# Altium schematic sheet SelfDrivingCar_SCH_PowerBoard.SchDoc: Power Distribution Schematic
size A; DocumentNumber: Power Distribution Schematic; SheetNumber: 3; SheetTotal: 7
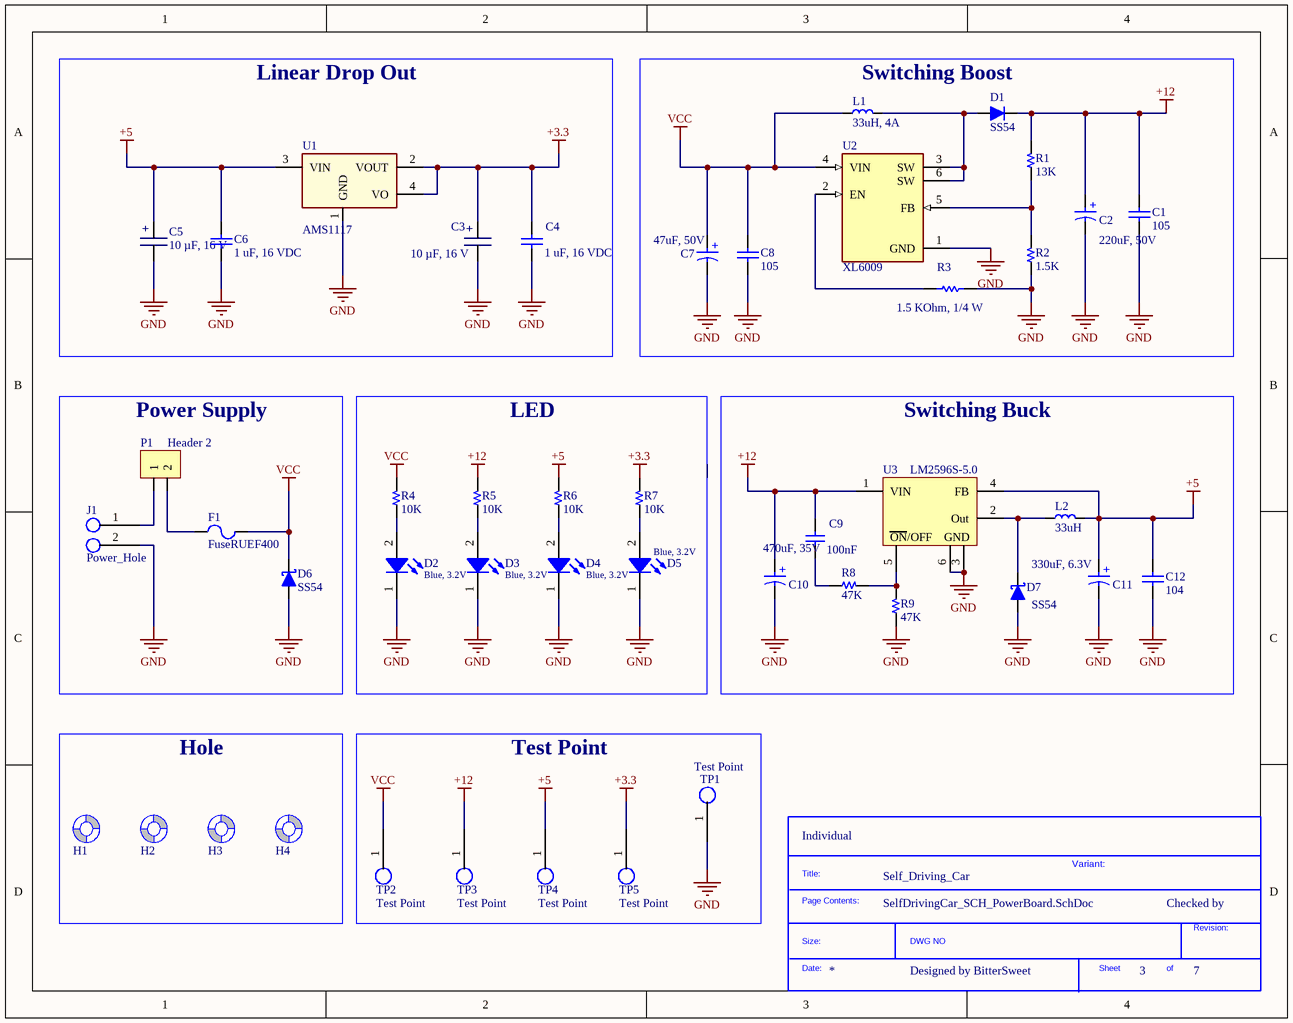
[diagram p0: SelfDrivingCar_SCH_PowerBoard.SchDoc]

## Parts
*?  SDTitleBlock  (value not drawn)  (graphical)
C1  105  [tu 1206]
C2  220uF, 50V  [WCAP-ASLI_D10H10.5]
C3  10 µF, 16 V  [TANTALUM SMD A]
C4  1 uF, 16 VDC  [CAP_0603]
C5  10 µF, 16 V  [TANTALUM SMD A]
C6  1 uF, 16 VDC  [CAP_0603]
C7  47uF, 50V  [WCAP-ASLI_D6.3H7.7]
C8  105  [tu 1206]
C9  100nF  [C 0805]
C10  470uF, 35V  [WCAP-ASLI_D10H10.5]
C11  330uF, 6.3V  [WCAP-ASLI_D6.3H7.7]
C12  104  [tu 0805]
D1  SS54  [DO-214AB (SMC)]
D2  Blue, 3.2V  [WL-SMCW_0805]
D3  Blue, 3.2V  [WL-SMCW_0805]
D4  Blue, 3.2V  [WL-SMCW_0805]
D5  Blue, 3.2V  [WL-SMCW_0805]
D6  SS54  [DO-214AC (SMA)]
D7  SS54  [DO-214AC (SMA)]
F1  FuseRUEF400  [FuseRUEF400]
H1  Screw Hole  [SCREW/3.2/7.0/M]  (value not drawn)  (no BOM)
H2  Screw Hole  [SCREW/3.2/7.0/M]  (value not drawn)  (no BOM)
H3  Screw Hole  [SCREW/3.2/7.0/M]  (value not drawn)  (no BOM)
H4  Screw Hole  [SCREW/3.2/7.0/M]  (value not drawn)  (no BOM)
J1  Power_Hole  [Power_Hole_2mm_THT]
L1  33uH, 4A  [Inductor SMD 12x12x8]
L2  33uH  [Inductor SMD 12x12x8]
P1  Header 2  [HDR/Terminal/2/3.5mm]
R1  13K  [R 0603]
R2  1.5K  [R 0603]
R3  1.5 KOhm, 1/4 W  [resistor_0603]
R4  10K  [R 0603]
R5  10K  [R 0603]
R6  10K  [R 0603]
R7  10K  [R 0603]
R8  47K  [R 0603]
R9  47K  [R 0603]
TP1  Test Point  [TP_1_5mm_SMD]
TP2  Test Point  [TP_1_5mm_SMD]
TP3  Test Point  [TP_1_5mm_SMD]
TP4  Test Point  [TP_1_5mm_SMD]
TP5  Test Point  [TP_1_5mm_SMD]
U1  AMS1117  [SOT-223]
U2  XL6009  [XL6009]
U3  LM2596S-5.0  [TO-263-5]

## Blocks framed on the sheet
Linear Drop Out: C3-C6 U1
Switching Boost: C1 C2 C7 C8 D1 L1 R1-R3 U2
Power Supply: D6 F1 J1 P1
LED: D2-D5 R4-R7
Switching Buck: C9-C12 D7 L2 R8 R9 U3
Hole: H1-H4
Test Point: TP1-TP5

## Nets
+3.3: C3.2 C4.2 R7.2 TP5.1 U1.2(VOUT) U1.4(VO)
+5: C5.2 C6.2 C11.1(P) C12.1 L2.2 R6.2 TP4.1 U1.3(VIN) U3.4(FB)
+12: C1.1 C2.1(P) C9.1 C10.1(P) D1.2(K) R1.2 R5.2 TP3.1 U3.1(VIN)
GND: C1.2 C2.2(N) C3.1 C4.1 C5.1 C6.1 C7.2(N) C8.2 C10.2(N) C11.2(N) C12.2 D2.1(K) D3.1(K) D4.1(K) D5.1(K) D6.1(A) D7.1(A) J1.2 R2.1 R3.2 R9.1 TP1.1 U1.1(GND) U2.1(GND) U3.3(GND) U3.6(PAD)
VCC: C7.1(P) C8.1 D6.2(K) F1.2 L1.1 R4.2 TP2.1 U2.4(VIN)
NetC9_2: C9.2 R8.1
NetD1_1: D1.1(A) L1.2 U2.3(SW) U2.6(SW)
NetD2_2: D2.2(A) R4.1
NetD3_2: D3.2(A) R5.1
NetD4_2: D4.2(A) R6.1
NetD5_2: D5.2(A) R7.1
NetD7_2: D7.2(K) L2.1 U3.2(Out)
NetF1_1: F1.1 P1.2
NetJ1_1: J1.1 P1.1
NetR1_1: R1.1 R2.2 U2.5(FB)
NetR3_1: R3.1 U2.2(EN)
NetR8_2: R8.2 R9.2 U3.5(~{ON}/OFF)

Not connected (* = marked no-connect by the designer): H1 1(Screw); H2 1(Screw); H3 1(Screw); H4 1(Screw)

## Notes on the sheet
- (near *?) Individual
- Self_Driving_Car
- Variant:
- Checked by
- Designed by BitterSweet
- (in symbol 01120610610) +
- (in symbol 865080145010) +
- (in symbol 865080645012) +
- (in symbol 865080657018) +
- (in symbol 0710101508650801570160U20) +
- (in symbol LM2596S-5.0) ON/OFF
- (in symbol SDTitleBlock) Title:; Page Contents:; Revision:; Size:; DWG NO; Date:; Sheet; of

## Library data of the parts
C1 C8 = Tu 1206 105 50V 20%: Dán; Don_Vi: Con; So_Chan: 2; Ten_Linh_Kien: Tụ 1206 105-1uF 10% 16V; Ma_Hang: MH004545; Chung_Loai: Dán; Kieu_Chan: *; ComponentLink1Description: URL; ComponentLink1URL: https://www.thegioiic.com/tu-gom-1206-1uf-16v; SUPPLIER NAME: JLCPCB; SUPPLIER SN: C141215; SUPPLIER URL: https://jlcpcb.com/partdetail/Kemet-C1206X105K5RAC7800/C141215
C2 = 865080657018: V-Chip, D10 x H10.5mm, 220uF, 50V; Manufacturer: Wurth Elektronik; Capacitance Tolerance: +/-20%; Dissipation Factor: 12%; Endurance: 2000h; Leakage Current: 110uA; Ripple Current: 650mA; Category: Aluminum Electrolytic Capacitors; ComponentLink2Description: Datasheet Link; ComponentLink2URL: https://www.we-online.com/redexpert/spec/865080657018?ad; Mount: Surface Mount; Operating Temperature Max: 105°C; Operating Temperature Min: -55°C; Packaging: Tape and Reel; Height: 10.5mm; Diameter: 10mm; Capacitance: 220uF; Rated Voltage (DC): 50V; Supplier 1 Name: Mouser; Supplier 1 SN: 710-865080657018; Supplier 1 URL: https://www.mouser.vn/ProductDetail/Wurth-Elektronik/865080657018?qs=0KOYDY2FL28CcgHzg1XTuA%3D%3D; Supplier 3 Name: thegioiic; Supplier 3 URL: https://www.thegioiic.com/tu-nhom-smd-220uf-50v-10x10-5mm; Manufacturer Part Number: N/A; Supplier 2 Name: Digi-Key; Supplier 2 SN: N/A; Supplier 2 URL: N/A; Supplier 3 SN: N/A; Value: 220uF, 50V; ComponentLink3Description: URL; ComponentLink3URL: https://www.thegioiic.com/tu-nhom-smd-220uf-50v-10x10-5mm; SUPPLIER NAME: JLCPCB; SUPPLIER SN: C5289735; SUPPLIER URL: https://jlcpcb.com/partdetail/aishi_aihua_group-EMK1HM221GB0D00R/C5289735
C3 C5 = 01120610610: CAP TANT 10uF 10% 16V 1206; Manufacture  Name: KYOCERA AVX; Manufacture  SN: TPSA106K016R1000; Capacitance Tolerance: +/-10%; ComponentLink1Description: Datasheet link; ComponentLink1URL: https://datasheets.kyocera-avx.com/TAJ.pdf; ComponentLink2Description: Supplier 1 URL; ComponentLink2URL: https://www.mouser.vn/ProductDetail/KYOCERA-AVX/TPSA106K016R1000?qs=GLv2FRWg8zkKT7IxHlCjvQ%3D%3D; Size: 1206; Mounting Technology: SMT; Capacitance: 10uF; ComponentLink3Description: Supplier 2 URL; ComponentLink3URL: https://www.digikey.com/en/products/detail/kyocera-avx/TPSA106K016R1000/7536120; ComponentLink4Description: Supplier 3 URL; ComponentLink4URL: https://www.thegioiic.com/tu-tantalum-10uf-16v-1206-taja106k016rnj; Supplier 1 Name: Mouser; Supplier 1 SN: 581-TPSA106K016R1000; Supplier 1 URL: https://www.mouser.vn/ProductDetail/KYOCERA-AVX/TPSA106K016R1000?qs=GLv2FRWg8zkKT7IxHlCjvQ%3D%3D; Supplier 2 Name: Digi-Key; Supplier 2 SN: 478-10757-1-ND; Supplier 2 URL: https://www.digikey.com/en/products/detail/kyocera-avx/TPSA106K016R1000/7536120; Supplier 3 Name: thegioiic; Supplier 3 SN: N/A; Supplier 3 URL: https://www.thegioiic.com/tu-tantalum-10uf-16v-1206-taja106k016rnj; Value: 10 µF, 16 V; Rated Voltage: 16 V; ComponentLink5Description: URL; ComponentLink5URL: https://www.thegioiic.com/tu-tantalum-10uf-16v-1206-taja106k016rnj; SUPPLIER NAME: JLCPCB; SUPPLIER SN: C128857; SUPPLIER URL: https://jlcpcb.com/partdetail/Yageo-CC1206KKX5R7BB106/C128857
C4 C6 = 0106031051016: CAP, size 0603, 1 uF, 16 VDC; Manufacture Name: Samsung Electro-Mechanics; Manufacture SN: CL10B105KO8NNWC; Capacitance: 1 uF; Tolerance: +/-10%; Voltage Rating DC: 16 VDC; ComponentLink2Description: Datasheet; ComponentLink2URL: https://www.mouser.vn/datasheet/2/585/Samsung_MLCC_1837944-1929650.pdf; Operating Temperature: -55 to +125degC; Packaging: Tape and Reel; Mounting Technology: SMT; Size: 0603; Supplier 1 Name: Mouser; Supplier 1 SN: 187-CL10B105KO8NNWC; Supplier 1 URL: https://www.mouser.vn/ProductDetail/Samsung-Electro-Mechanics/CL10B105KO8NNWC?qs=81r%252BiQLm7BT%252BXtc72qn1ug%3D%3D&utm_source=mouser-refine-download&utm_medium=file&utm_campaign=CL10B105KO8NNWC&utm_content=Samsung-Electro-Mechanics; Supplier 2 Name: Digi-Key; Supplier 2 SN: 1276-CL10B105KO8NNWCTR-ND; Supplier 2 URL: https://www.digikey.com/en/products/detail/samsung-electro-mechanics/cl10b105ko8nnwc/16572783; Supplier 3 Name: thegioiic; Supplier 3 SN: N/A; Supplier 3 URL: https://www.thegioiic.com/tu-gom-0603-1uf-16v; Value: 1 uF, 16 VDC; SUPPLIER NAME: JLCPCB; SUPPLIER SN: C76706; SUPPLIER URL: https://jlcpcb.com/partdetail/Tdk-CGA3E1X7R1C105KT0Y0N/C76706
C7 = 865080645012: V-Chip, D6.3 x H7.7mm, 47uF, 50V; Manufacturer: Wurth Elektronik; Capacitance Tolerance: +/-20%; Dissipation Factor: 12%; Endurance: 2000h; Leakage Current: 23.5uA; Ripple Current: 230mA; Category: Aluminum Electrolytic Capacitors; ComponentLink2Description: Datasheet Link; ComponentLink2URL: https://www.thegioiic.com/tu-nhom-smd-47uf-50v-6-3x7-7mm; Mount: Surface Mount; Operating Temperature Max: 105°C; Operating Temperature Min: -55°C; Packaging: Tape and Reel; Height: 7.7mm; Diameter: 6.3mm; Capacitance: 47uF; Rated Voltage (DC): 50V; Supplier 1 Name: Mouser; Supplier 1 SN: 710-865080645012; Supplier 1 URL: https://www.mouser.vn/ProductDetail/Wurth-Elektronik/865080645012?qs=0KOYDY2FL2%252BvvLOdOSK4rA%3D%3D&_gl=1*1ey7vig*_ga*MTg2NTM2NjU1Mi4xNjkwOTM2MTU0*_ga_15W4STQT4T*MTY5MDkzNjE1NC4xLjAuMTY5MDkzNjE1Ny4wLjAuMA..*_ga_1KQLCYKRX3*MTY5MDkzNjE1NC4xLjAuMTY5MDkzNjE1Ny41Ny4wLjA.; Supplier 3 Name: thegioiic; Supplier 3 URL: https://www.thegioiic.com/tu-nhom-smd-47uf-50v-6-3x7-7mm; Manufacturer Part Number: N/A; Supplier 2 Name: Digi-Key; Supplier 2 SN: N/A; Supplier 2 URL: N/A; Supplier 3 SN: N/A; Value: 47uF, 50V; ComponentLink3Description: URL; ComponentLink3URL: https://www.thegioiic.com/tu-nhom-smd-47uf-50v-6-3x7-7mm; SUPPLIER NAME: JLCPCB; SUPPLIER SN: C445256; SUPPLIER URL: https://jlcpcb.com/partdetail/Nichicon-UUD1H470MCL1GS/C445256
C9 = Capacitor NP: Capacitor non-pol; ComponentLink1Description: URL; ComponentLink1URL: https://www.thegioiic.com/tu-gom-0603-100nf-0-1uf-50v; SUPPLIER NAME: JLCPCB; SUPPLIER SN: C779984; SUPPLIER URL: https://jlcpcb.com/partdetail/-08055C104K4Z2A/C779984
C10 = 0710101508650801570160U20: V-Chip, D10 x H10.5mm, 470uF, 35V; Manufacturer: Wurth Elektronik; Capacitance Tolerance: +/-20%; Dissipation Factor: 24%; Endurance: 2000h; Leakage Current: 94.5uA; Rated Voltage (DC): 6.3V; Ripple Current: 650mA; Category: Aluminum Electrolytic Capacitors; ComponentLink2Description: Datasheet Link; ComponentLink2URL: https://www.we-online.com/redexpert/spec/865080157016?ad; Mount: Surface Mount; Operating Temperature Max: 105°C; Operating Temperature Min: -55°C; Packaging: Tape and Reel; Height: 10.5mm; Diameter: 10mm; Capacitance: 470uF; Supplier 1 Name: Mouser; Supplier 1 SN: 710-865080157016; Supplier 1 URL: https://www.mouser.vn/ProductDetail/Wurth-Elektronik/865080157016?qs=0KOYDY2FL29k8EDLGk1i5Q%3D%3D; Supplier 3 Name: thegioiic; Supplier 3 URL: https://www.mouser.vn/ProductDetail/Wurth-Elektronik/865080157016?qs=0KOYDY2FL29k8EDLGk1i5Q%3D%3D; Manufacturer Part Number: N/A; Supplier 2 Name: Digi-Key; Supplier 2 SN: N/A; Supplier 2 URL: https://www.thegioiic.com/tu-nhom-smd-470uf-35v-10x10-5mm; Supplier 3 SN: N/A; Value: 470uF, 35V; SUPPLIER NAME: JLCPCB; SUPPLIER SN: C3039779; SUPPLIER URL: https://jlcpcb.com/partdetail/3595245-VT477M035GA5RR0NB1VP0/C3039779
C11 = 865080145010: V-Chip, D6.3 x H7.7mm, 330uF, 16V; Manufacturer: Wurth Elektronik; Capacitance Tolerance: +/-20%; Dissipation Factor: 24%; Endurance: 2000h; Leakage Current: 20.79uA; Ripple Current: 275mA; Manufacturer Part Number: 865080145010; Category: Aluminum Electrolytic Capacitors; ComponentLink2Description: Datasheet Link; ComponentLink2URL: https://www.we-online.com/redexpert/spec/865080145010?ad; Mount: Surface Mount; Operating Temperature Max: 105°C; Operating Temperature Min: -55°C; Packaging: Tape and Reel; Height: 7.7mm; Diameter: 6.3mm; Capacitance: 330uF; Rated Voltage (DC): 16V; Supplier 1 Name: Mouser; Supplier 1 SN: 710-865080145010; Supplier 1 URL: https://www.mouser.vn/ProductDetail/Wurth-Elektronik/865080145010?qs=0KOYDY2FL2%252B70aKe3MLQSg%3D%3D; Supplier 3 Name: thegioiic; Supplier 3 URL: https://www.thegioiic.com/tu-nhom-smd-330uf-6-3v-6-3x7-7mm; Supplier 2 Name: Digi-Key; Supplier 2 SN: N/A; Supplier 2 URL: N/A; Supplier 3 SN: N/A; Value: 330uF, 16V; SUPPLIER NAME: JLCPCB; SUPPLIER SN: C962163; SUPPLIER URL: https://jlcpcb.com/partdetail/1043489-EMZR160ARA331MF80G/C962163
C12 = Tu 0805 104 50V 10%: Dán; Don_Vi: Con; So_Chan: 2; Ten_Linh_Kien: Tụ 0805 104-100nF 10% 50V; Ma_Hang: MH004551; Chung_Loai: Dán; Kieu_Chan: *; ComponentLink1Description: URL; ComponentLink1URL: https://www.thegioiic.com/tu-gom-0805-100nf-0-1uf-50v; SUPPLIER NAME: JLCPCB; SUPPLIER SN: C840115; SUPPLIER URL: https://jlcpcb.com/partdetail/HuiJu-NL0805B104J500CPBN/C840115
D1 = Diode: SS54 SMC Diode Schottky 5A 40V; ComponentLink1Description: URL; ComponentLink1URL: https://www.thegioiic.com/ss54-smc-diode-schottky-5a-40v; SUPPLIER SN: *; SUPPLIER NAME: JLCPCB; SUPPLIER URL: *
D2-D5 = 160805BlueClear: WL-SMCW SMT Mono-color Chip LED Waterclear, size 0805, Blue, 3.2V, 140deg; Type: Clear; Color: Blue; Size: 0603; ComponentLink1Description: Datasheet link; ComponentLink1URL: N/A; ComponentLink2Description: Supplier 1 URL; ComponentLink2URL: https://www.mouser.vn/ProductDetail/Wurth-Elektronik/150080BS75000?qs=2kOmHSv6VfT2tBo3UPVqAQ%3D%3D; ComponentLink3Description: Supplier 2 URL; ComponentLink3URL: https://www.digikey.com/en/products/detail/liteon/LTST-C170TBKT/388527; ComponentLink4Description: Supplier 3 URL; ComponentLink4URL: https://www.thegioiic.com/led-xanh-duong-0805-dan-smd-trong-suot-harvatek; Supplier 1 Name: Mouser; Supplier 1 SN: 710-150080BS75000; Supplier 1 URL: https://www.mouser.vn/ProductDetail/Wurth-Elektronik/150080BS75000?qs=2kOmHSv6VfT2tBo3UPVqAQ%3D%3D; Supplier 2 Name: Digi-Key; Supplier 2 SN: 160-1579-2-ND; Supplier 2 URL: https://www.digikey.com/en/products/detail/liteon/LTST-C170TBKT/388527; Supplier 3 Name: ICDayRoi; Supplier 3 SN: N/A; Supplier 3 URL: https://www.thegioiic.com/led-xanh-duong-0805-dan-smd-trong-suot-harvatek; Value: Blue, 3.2V; SUPPLIER NAME: JLCPCB; SUPPLIER SN: *; SUPPLIER URL: *
D6 D7 = Diode Schottky: Schottky Diode; SUPPLIER SN: *; SUPPLIER NAME: JLCPCB; ComponentLink1Description: URL; ComponentLink1URL: https://www.thegioiic.com/ss54-sma-diode-shotky-5a-40v; SUPPLIER URL: *
F1 = FuseRUEF400: RUEF400 30V 4A; SUPPLIER SN: *; SUPPLIER NAME: JLCPCB; SUPPLIER URL: *
J1 = Power_Hole: Power Hole, THT
L1 L2 = Inductor: ComponentLink1Description: URL; ComponentLink1URL: https://www.thegioiic.com/cdrh127-cuon-cam-dan-smd-1280-330-33uh-4-2a; SUPPLIER NAME: JLCPCB; SUPPLIER SN: *; SUPPLIER URL: *
P1 = Header 2: Header, 2-Pin; ComponentLink1Description: URL; ComponentLink1URL: https://www.thegioiic.com/kf128-2-v-domino-2-chan-thang-3-5mm-300v-10a-han-pcb
R1 R2 R4-R9 = Resistor: ComponentLink1Description: URL; SUPPLIER NAME: JLCPCB
  R1: ComponentLink1URL: https://www.thegioiic.com/dien-tro-13-kohm-0603-1-; SUPPLIER SN: C365383; SUPPLIER URL: https://jlcpcb.com/partdetail/Resi-ETCR0603F13K0K9/C365383
  R2: ComponentLink1URL: https://www.thegioiic.com/dien-tro-1-5-kohm-0603-1-; SUPPLIER SN: C445824; SUPPLIER URL: https://jlcpcb.com/partdetail/Panasonic-ERJPA3J152V/C445824
  R4-R7: ComponentLink1URL: https://www.thegioiic.com/dien-tro-10-kohm-0603-1-; SUPPLIER SN: C2989345; SUPPLIER URL: https://jlcpcb.com/partdetail/3448768-TC0325D1002T5F/C2989345
  R8 R9: ComponentLink1URL: https://www.thegioiic.com/dien-tro-47-kohm-0603-1-; SUPPLIER SN: *; SUPPLIER URL: *
R3 = 0006031525: RES, size 0603, 1.5 KOhm, 1/4 W; Manufacture  Name: Panasonic; Rated Power: 1/4 W; Resistance Tolerance: +/-5%; Size: 0603; Mounting Technology: SMT; Resistance: 1.5 KOhm; Supplier 1 Name: Mouser; Supplier 1 SN: 667-ERJ-PA3J152V; Supplier 1 URL: https://www.mouser.vn/ProductDetail/Panasonic/ERJ-PA3J152V?qs=BzJM0faLVqVoRX2ZXjooUw%3D%3D; Supplier 2 Name: Digi-Key; Supplier 2 SN: P1.5KBZTR-ND - Tape & Reel (TR); Supplier 3 Name: thegioiic; Supplier 3 SN: N/A; Supplier 3 URL: https://www.thegioiic.com/dien-tro-1-5-kohm-0603-1-; Manufacture  SN: https://www.mouser.vn/ProductDetail/Panasonic/ERJ-PA3J152V?qs=BzJM0faLVqVoRX2ZXjooUw%3D%3D; Value: 1.5 KOhm, 1/4 W; ComponentLink1Description: Datasheet link; ComponentLink1URL: https://www.mouser.vn/datasheet/2/315/Panasonic_Resistors_Thick_Film_Anti_Sulf_Anti_Surg-1825099.pdf; ComponentLink2Description: Supplier 1 URL; ComponentLink2URL: N/A; ComponentLink3Description: Supplier 2 URL; ComponentLink3URL: https://www.digikey.com/en/products/detail/panasonic-electronic-components/ERJ-PA3J152V/5035991?s=N4IgTCBcDaIGxwOwFoCiAlAUsgCgQQGZMBGAVjADUQBdAXyA; ComponentLink4Description: Supplier 3 URL; ComponentLink4URL: N/A; Supplier 2 URL: https://www.digikey.com/en/products/detail/panasonic-electronic-components/ERJ-PA3J152V/5035991?s=N4IgTCBcDaIGxwOwFoCiAlAUsgCgQQGZMBGAVjADUQBdAXyA; SUPPLIER NAME: JLCPCB; SUPPLIER SN: C445824; SUPPLIER URL: https://jlcpcb.com/partdetail/Panasonic-ERJPA3J152V/C445824
U1 = AMS1117: 1A LDO Voltage Regulator, ADJ or fixed 1.5/1.8/2.5/2.85/3.3/5V; SUPPLIER NAME: JLCPCB; SUPPLIER SN: C6186; SUPPLIER URL: https://jlcpcb.com/partdetail/Advanced_MonolithicSystems-AMS1117_33/C6186
U2 = XL6009: IC switching boost voltage; ComponentLink1Description: URL; ComponentLink1URL: https://www.thegioiic.com/xl6009-ic-dieu-chinh-tang-ap-5a-to-263-5; SUPPLIER NAME: JLCPCB; SUPPLIER URL: *
U3 = LM2596S-5.0: Simple Switcher 3A Step-Down Voltage Regulator; ComponentLink1Description: URL; ComponentLink1URL: https://www.thegioiic.com/lm2596s-5-0-ic-dieu-chinh-giam-ap-5v-3a-to-263-5; ComponentLink2Description: New link; ComponentLink2URL: *; SUPPLIER NAME: JLCPCB; SUPPLIER SN: C347421; SUPPLIER URL: https://jlcpcb.com/partdetail/324081-LM2596S_50/C347421
H1-H4 = Screw Hole: TYPE: NO-BOM; UNIT PRICE: 0